# Altium project SB_Valve_3_v1.1.PrjPcb
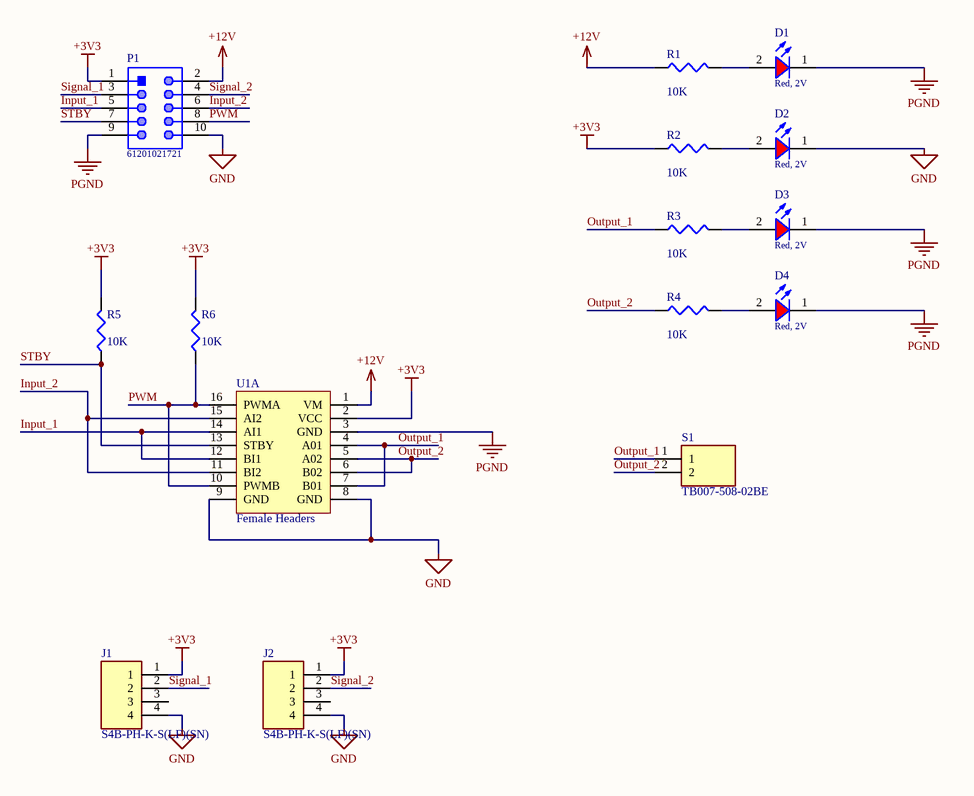
[diagram p0: SB_Valve_3_v1.1.SchDoc]
1 sheet, 15 parts. Net scope: global (net labels, ports and power ports of the same name join across sheets).
Board file: SB_Valve_3_v1.1.PcbDoc

## Sheet SB_Valve_3_v1.1.SchDoc
size A4

### Parts
D1  Red, 2V  [WL-SMSW_0603_Rectangular]
D2  Red, 2V  [WL-SMSW_0603_Rectangular]
D3  Red, 2V  [WL-SMSW_0603_Rectangular]
D4  Red, 2V  [WL-SMSW_0603_Rectangular]
J1  S4B-PH-K-S(LF)(SN)  [JST_S4B-PH-K-S(LF)(SN)]
J2  S4B-PH-K-S(LF)(SN)  [JST_S4B-PH-K-S(LF)(SN)]
P1  61201021721  [61201021721]
R1  value 10K  [J1-0603]  (hidden comment: R4)
R2  value 10K  [J1-0603]  (hidden comment: R3)
R3  value 10K  [J1-0603]  (hidden comment: R5)
R4  value 10K  [J1-0603]  (hidden comment: R6)
R5  value 10K  [J1-0603]  (hidden comment: R2)
R6  value 10K  [J1-0603]  (hidden comment: R1)
S1  TB007-508-02BE  [CUI_TB007-508-02BE]
U1  Female Headers  [TB6612FNG]  (part A of 2)

### Nets
+3V3: J1.1 J2.1 P1.1 R2.1 R5.2 R6.2 U1.2(VCC)
+12V: P1.2 R1.1 U1.1(VM)
GND: D2.1(K) J1.4 J2.4 P1.10 U1.8(GND) U1.9(GND)
PGND: D1.1(K) D3.1(K) D4.1(K) P1.9 U1.3(GND)
Input_1: P1.5 U1.12(BI1) U1.14(AI1)
Input_2: P1.6 U1.11(BI2) U1.15(AI2)
Output_1: R3.1 S1.1 U1.4(A01) U1.7(B01)
Output_2: R4.1 S1.2 U1.5(A02) U1.6(B02)
PWM: P1.8 R6.1 U1.10(PWMB) U1.16(PWMA)
Signal_1: J1.2 P1.3
Signal_2: J2.2 P1.4
STBY: P1.7 R5.1 U1.13(STBY)
NetD1_2: D1.2(A) R1.2
NetD2_2: D2.2(A) R2.2
NetD3_2: D3.2(A) R3.2
NetD4_2: D4.2(A) R4.2

Not connected (* = marked no-connect by the designer): J1 3; J2 3

### Library data of the parts
D1-D4 = 155060RS75300: WL-SMSW SMT Mono-color Side View Waterclear, size 0603, Red, 2V, 140deg; Manufacturer: Wurth Elektronik; Chip Technology: AlInGaP; Dominant Wavelength typ.: 625nm; Luminous Intensity typ.: 150mcd; Peak Wavelength typ.: 630nm; Viewing Angle: 140deg; ComponentLink1Description: Manufacturer; ComponentLink1URL: http://www.we-online.de; ComponentLink2URL: https://www.we-online.com/catalog/datasheet/155060RS75300.pdf; ComponentLink2Description: Datasheet; Forward Voltage typ.: 2V; Emitting Color: Red; Mounting Technology: SMT; Operating Temperature: -40 to +85degC; Published Date: October 2020; Manufacturer Part Number: 155060RS75300; Packaging: Tape and Reel; Size: 0603
J1 J2 = S4B-PH-K-S(LF)(SN): Connector Header Through Hole, Right Angle 4 position 0.079 _2.00mm_; MP: S4B-PH-K-S_LF__SN_; MF: JST Sales; Price: None; Package: None; Value: *; Availability: Unavailable; SnapEDA_Link: https://www.snapeda.com/parts/S4B-PH-K-S%28LF%29%28SN%29/JST%20Sales%20America%20Inc./view-part/591324/?ref=snap
P1 = CMP-1502-00021-1: Male Box Header WR-BHD, THT, Angled, pitch 2.54 mm, 10 pins; Manufacturer: Wurth Elektronik; Pin Number: 10; Contact Resistance: 20mOhm; Working Voltage: 250VAC; Pitch: 2.54mm; Withstanding Voltage: 500VAC; Mounting Technology: THT; Publisher: WurthElektronik; Gender: Male; Part Number: 61201021721; Package Reference: 61201021721; Orientation: Angled; Published Date: August2018; Packaging: Tray; Manufacturer URL: http://www.we-online.de; Operating Temperature: -40to125degC; Datasheet URL: https://katalog.we-online.de/em/datasheet/6120xx21721.pdf
R1-R6 = Res3: Resistor; Published: 8-Jun-2000; LatestRevisionDate: 29-May-2009; LatestRevisionNote: IPC-7351 Footprint Added.; PackageReference: J1-0603; Publisher: Altium Limited; PackageDescription: Chip Resistor
S1 = TB007-508-02BE: 2~24 Poles, Screw Type, Horizontal, 5.08 Pitch, 24~12 _AWG_, Terminal Block Connector; MF: CUI Devices; SnapEDA_Link: https://www.snapeda.com/parts/TB007-508-02BE/CUI%20Devices/view-part/3591212/?ref=snap; Value: *; Availability: Unavailable; MP: TB007-508-02BE; Price: None; Package: None
U1 = TB6612FNG Female: Motor Driver